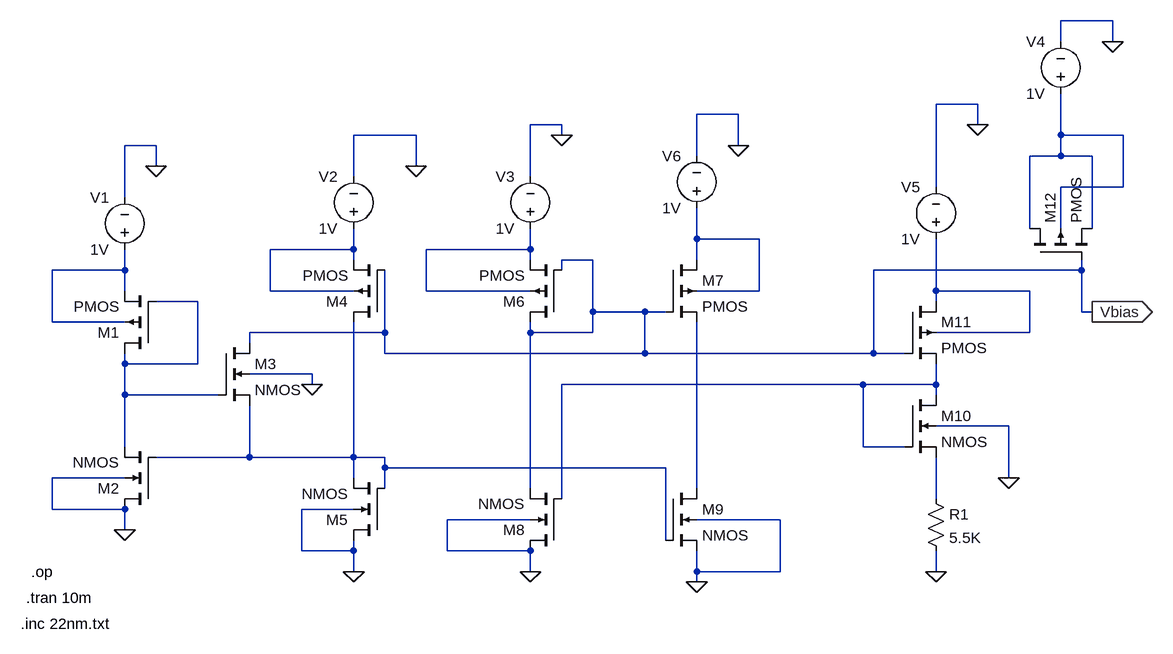
[diagram p0: schematic 22nm1st.asc]
22nm1st.asc, the LTspice schematic file:
Version 4
SHEET 1 1356 680
WIRE 1264 -272 1184 -272
WIRE 1184 -240 1184 -272
WIRE 1264 -240 1264 -272
WIRE 1056 -144 992 -144
WIRE 688 -128 624 -128
WIRE 416 -112 368 -112
WIRE 1056 -112 1056 -144
WIRE 192 -96 96 -96
WIRE 416 -96 416 -112
WIRE 1184 -96 1184 -160
WIRE 1280 -96 1184 -96
WIRE -208 -80 -256 -80
WIRE 688 -80 688 -128
WIRE 624 -64 624 -128
WIRE 1184 -64 1184 -96
WIRE 1184 -64 1136 -64
WIRE 1232 -64 1184 -64
WIRE -208 -48 -208 -80
WIRE 192 -48 192 -96
WIRE 96 -32 96 -96
WIRE 368 -32 368 -112
WIRE 992 -16 992 -144
WIRE 1280 -16 1280 -96
WIRE 1280 -16 1184 -16
WIRE -256 0 -256 -80
WIRE 1136 48 1136 -64
WIRE 1184 48 1184 -16
WIRE 1232 48 1232 -64
WIRE 624 64 624 16
WIRE 720 64 624 64
WIRE 96 80 96 48
WIRE 96 80 -32 80
WIRE 368 80 368 48
WIRE 368 80 208 80
WIRE 96 96 96 80
WIRE 368 96 368 80
WIRE 464 96 416 96
WIRE 624 96 624 64
WIRE -256 112 -256 80
WIRE -256 112 -368 112
WIRE 416 112 416 96
WIRE 1216 112 1216 96
WIRE 1216 112 896 112
WIRE -256 144 -256 112
WIRE -32 144 -32 80
WIRE 96 144 -32 144
WIRE 208 144 208 80
WIRE 368 144 208 144
WIRE 720 144 720 64
WIRE 720 144 624 144
WIRE 992 144 992 64
WIRE 1136 144 992 144
WIRE -144 160 -208 160
WIRE 992 160 992 144
WIRE 464 176 464 96
WIRE 544 176 464 176
WIRE 576 176 544 176
WIRE 1216 176 1216 112
WIRE 1232 176 1216 176
WIRE -368 192 -368 112
WIRE -256 192 -368 192
WIRE 144 208 144 112
WIRE 144 208 -64 208
WIRE 368 208 368 192
WIRE 464 208 464 176
WIRE 464 208 368 208
WIRE 1136 208 1136 144
WIRE 1136 208 992 208
WIRE -64 224 -64 208
WIRE 144 240 144 208
WIRE 544 240 544 176
WIRE 544 240 144 240
WIRE 896 240 896 112
WIRE 896 240 544 240
WIRE 944 240 896 240
WIRE -256 256 -256 240
WIRE -144 256 -144 160
WIRE -144 256 -256 256
WIRE 32 272 -64 272
WIRE 32 288 32 272
WIRE 880 288 416 288
WIRE 992 288 992 256
WIRE 992 288 880 288
WIRE -256 304 -256 256
WIRE -112 304 -256 304
WIRE 992 304 992 288
WIRE 1104 352 992 352
WIRE -256 384 -256 304
WIRE 880 384 880 288
WIRE 944 384 880 384
WIRE -64 400 -64 320
WIRE -64 400 -208 400
WIRE 96 400 96 192
WIRE 96 400 -64 400
WIRE 144 400 96 400
WIRE 144 416 144 400
WIRE 576 416 144 416
WIRE -256 432 -368 432
WIRE 96 432 96 400
WIRE 1104 432 1104 352
WIRE 144 448 144 416
WIRE 368 448 368 208
WIRE 624 448 624 192
WIRE 416 464 416 288
WIRE 992 464 992 400
WIRE -368 480 -368 432
WIRE -256 480 -368 480
WIRE 96 480 16 480
WIRE 368 496 240 496
WIRE 752 496 624 496
WIRE -256 512 -256 480
WIRE 576 528 576 416
WIRE 16 544 16 480
WIRE 96 544 96 528
WIRE 96 544 16 544
WIRE 240 544 240 496
WIRE 368 544 240 544
WIRE 96 576 96 544
WIRE 368 576 368 544
WIRE 624 576 624 544
WIRE 752 576 752 496
WIRE 752 576 624 576
WIRE 992 576 992 544
WIRE 624 592 624 576
FLAG -208 -48 0
FLAG -256 512 0
FLAG 192 -48 0
FLAG 416 -96 0
FLAG 96 576 0
FLAG 368 576 0
FLAG 624 592 0
FLAG 1056 -112 0
FLAG 1264 -240 0
FLAG 992 576 0
FLAG 688 -80 0
FLAG 1232 176 Vbias
IOPIN 1232 176 Out
FLAG 32 288 0
FLAG 1104 432 0
DATAFLAG 1216 160 ""
SYMBOL voltage -256 96 R180
WINDOW 0 24 96 Left 2
WINDOW 3 24 16 Left 2
WINDOW 123 0 0 Left 0
WINDOW 39 0 0 Left 0
SYMATTR InstName V1
SYMATTR Value 1V
SYMBOL pmos4 -208 240 R180
SYMATTR InstName M1
SYMATTR Value2 l=22n w=11n
SYMBOL nmos4 -208 480 R180
SYMATTR InstName M2
SYMATTR Value2 l=44n w=220n
SYMBOL nmos4 -112 224 R0
SYMATTR InstName M3
SYMATTR Value2 l=44n w=88n
SYMBOL pmos4 144 192 R180
SYMATTR InstName M4
SYMATTR Value2 l=22n w=528n
SYMBOL voltage 96 64 R180
WINDOW 0 24 96 Left 2
WINDOW 3 24 16 Left 2
WINDOW 123 0 0 Left 0
WINDOW 39 0 0 Left 0
SYMATTR InstName V2
SYMATTR Value 1V
SYMBOL nmos4 144 528 R180
SYMATTR InstName M5
SYMATTR Value2 l=44n w=220n
SYMBOL pmos4 416 192 R180
SYMATTR InstName M6
SYMATTR Value2 l=44n w=528n
SYMBOL pmos4 576 96 R0
SYMATTR InstName M7
SYMATTR Value2 l=44n w=528n
SYMBOL voltage 368 64 R180
WINDOW 0 24 96 Left 2
WINDOW 3 24 16 Left 2
WINDOW 123 0 0 Left 0
WINDOW 39 0 0 Left 0
SYMATTR InstName V3
SYMATTR Value 1V
SYMBOL nmos4 416 544 R180
SYMATTR InstName M8
SYMATTR Value2 l=44n w=220n
SYMBOL nmos4 576 448 R0
SYMATTR InstName M9
SYMATTR Value2 l=44n w=220n
SYMBOL nmos4 944 304 R0
SYMATTR InstName M10
SYMATTR Value2 l=44n w=660n
SYMBOL pmos4 944 160 R0
SYMATTR InstName M11
SYMATTR Value2 l=44n w=528n
SYMBOL pmos4 1136 96 R270
SYMATTR InstName M12
SYMATTR Value2 l=110n w=1100n
SYMBOL voltage 1184 -144 R180
WINDOW 0 24 96 Left 2
WINDOW 3 24 16 Left 2
WINDOW 123 0 0 Left 0
WINDOW 39 0 0 Left 0
SYMATTR InstName V4
SYMATTR Value 1V
SYMBOL voltage 992 80 R180
WINDOW 0 24 96 Left 2
WINDOW 3 24 16 Left 2
WINDOW 123 0 0 Left 0
WINDOW 39 0 0 Left 0
SYMATTR InstName V5
SYMATTR Value 1V
SYMBOL res 976 448 R0
SYMATTR InstName R1
SYMATTR Value 5.5K
SYMBOL voltage 624 32 R180
WINDOW 0 24 96 Left 2
WINDOW 3 24 16 Left 2
WINDOW 123 0 0 Left 0
WINDOW 39 0 0 Left 0
SYMATTR InstName V6
SYMATTR Value 1V
TEXT -408 616 Left 2 !.tran 10m
TEXT -416 656 Left 2 !.inc 22nm.txt
TEXT -400 576 Left 2 !.op

The netlist it stands for:
* 22nm1st.asc
V1 N005 0 1V
M1 N007 N007 N005 N005 PMOS l=22n w=11n
M2 0 N009 N007 0 NMOS l=44n w=220n
M3 Vbias N007 N009 0 NMOS l=44n w=88n
M4 N009 Vbias N003 N003 PMOS l=22n w=528n
V2 N003 0 1V
M5 0 N009 N009 0 NMOS l=44n w=220n
M6 Vbias Vbias N004 N004 PMOS l=44n w=528n
M7 N002 Vbias N010 N002 PMOS l=44n w=528n
V3 N004 0 1V
M8 0 N008 Vbias 0 NMOS l=44n w=220n
M9 N010 N009 0 0 NMOS l=44n w=220n
M10 N008 N008 N011 0 NMOS l=44n w=660n
M11 N006 Vbias N008 N006 PMOS l=44n w=528n
M12 N001 Vbias N001 N001 PMOS l=110n w=1100n
V4 N001 0 1V
V5 N006 0 1V
R1 N011 0 5.5K
V6 N002 0 1V
.model NMOS NMOS
.model PMOS PMOS
.lib standard.mos
.tran 10m
.inc 22nm.txt
.op
.backanno
.end